# EAGLE schematic mem_board (EAGLE 6.4)
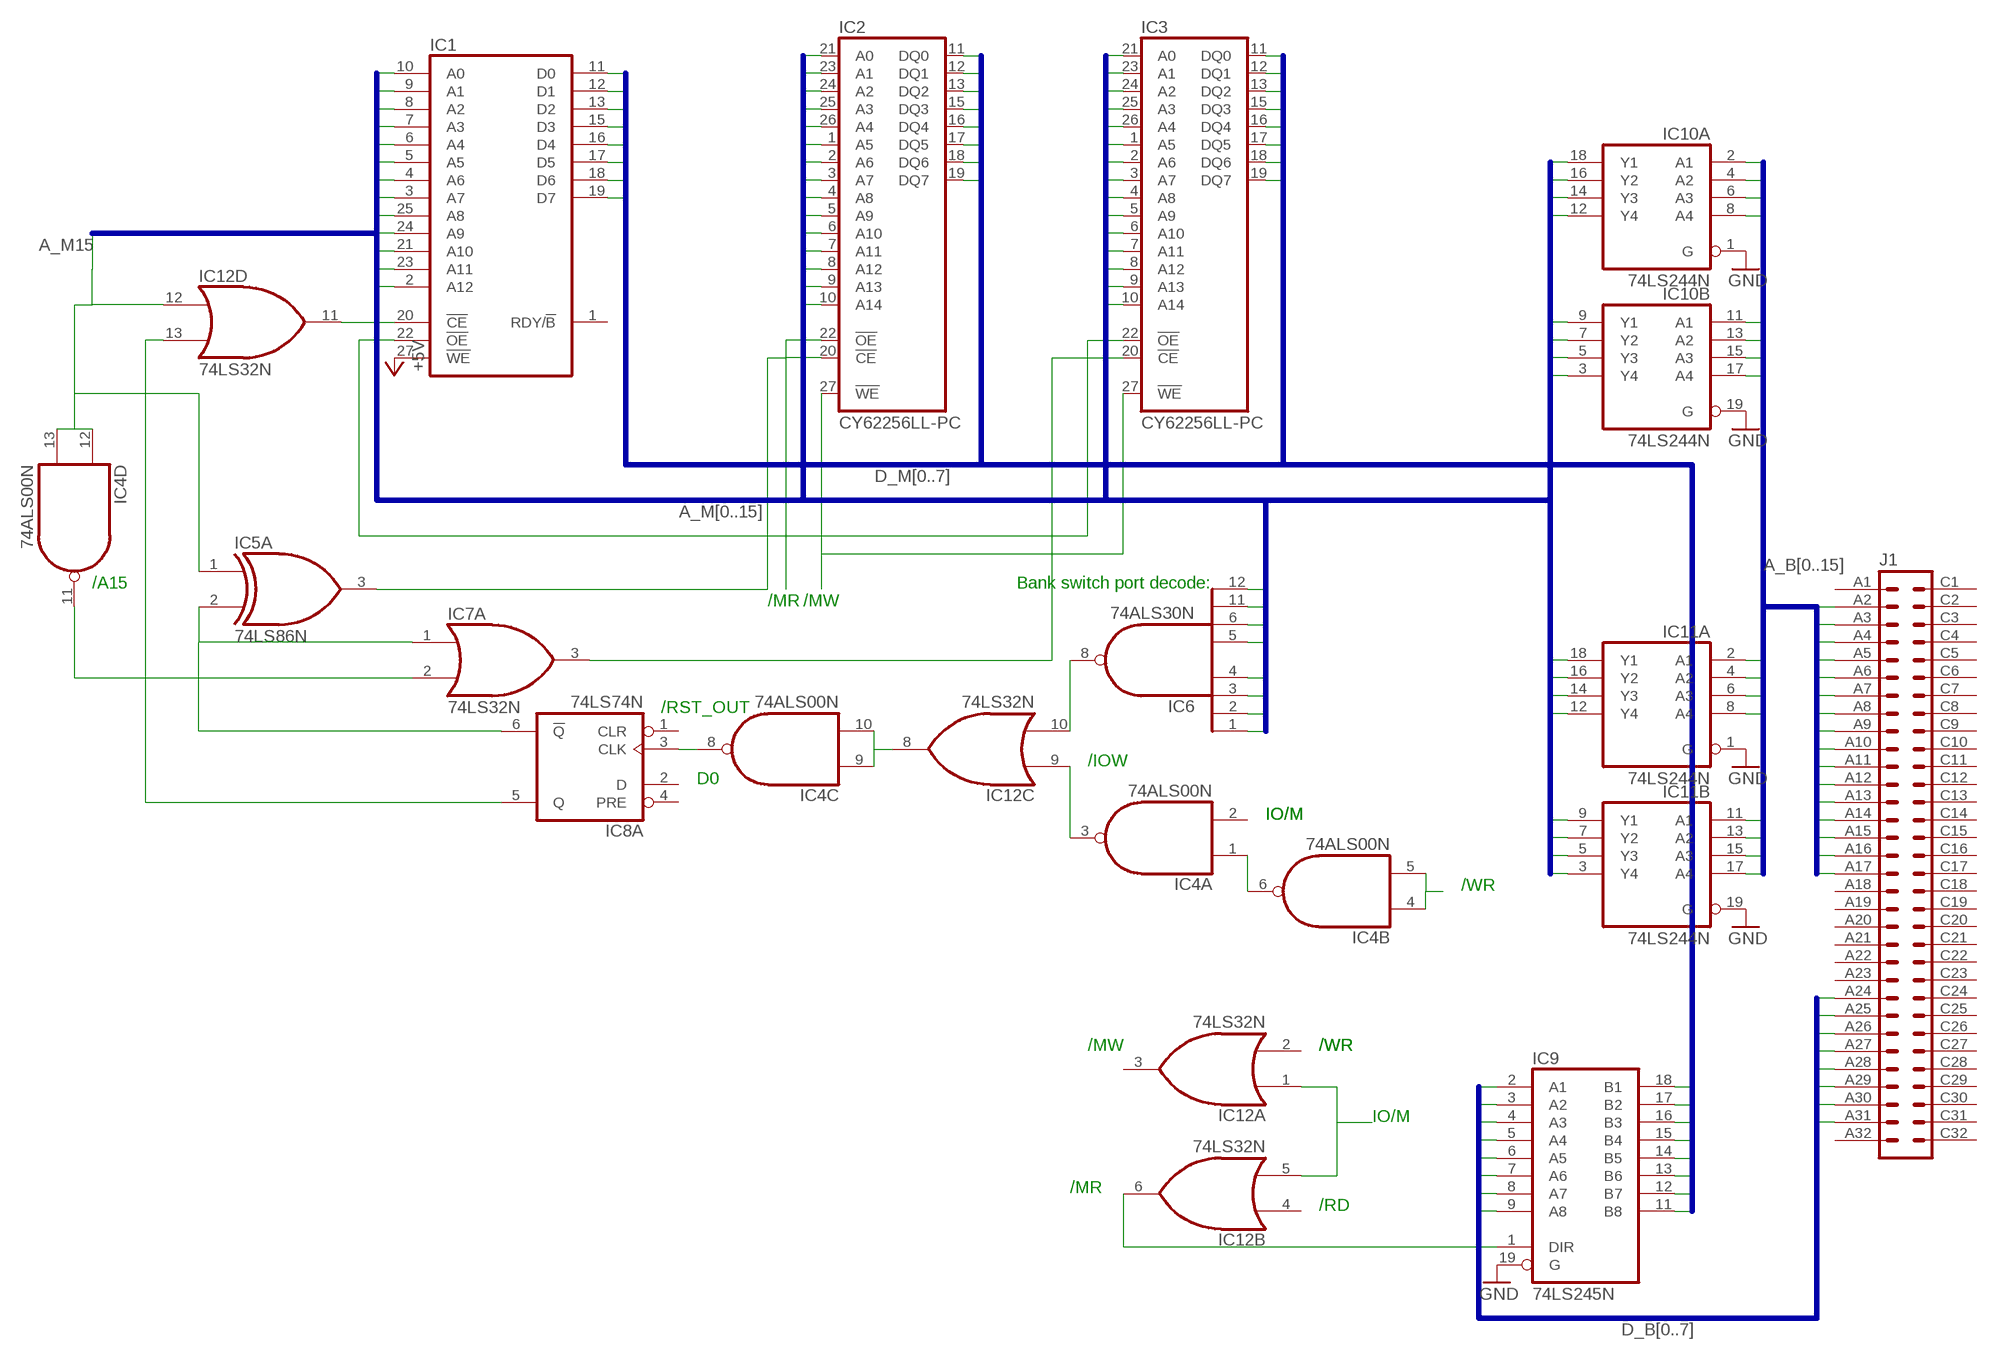
[diagram p0: schematic, sheet 1]

## Parts
IC1  2864  [DIL28]
IC2  CY62256LL-PC  [DIL28-6]
IC3  CY62256LL-PC  [DIL28-6]
IC4  74ALS00N  [DIL14]
IC5  74LS86N  [DIL14]
IC6  74ALS30N  [DIL14]
IC7  74LS32N  [DIL14]
IC8  74LS74N  [DIL14]
IC9  74LS245N  [DIL20]
IC10  74LS244N  [DIL20]
IC11  74LS244N  [DIL20]
IC12  74LS32N  [DIL14]
J1  VG64  [VG64]

## Nets
+5V: IC1.27(!WE)
A_B0: IC10.2(A:A1) J1.A2
A_B1: IC10.4(A:A2) J1.A3
A_B2: IC10.6(A:A3) J1.A4
A_B3: IC10.8(A:A4) J1.A5
A_B4: IC10.11(B:A1) J1.A6
A_B5: IC10.13(B:A2) J1.A7
A_B6: IC10.15(B:A3) J1.A8
A_B7: IC10.17(B:A4) J1.A9
A_B8: IC11.2(A:A1) J1.A10
A_B9: IC11.4(A:A2) J1.A11
A_B10: IC11.6(A:A3) J1.A12
A_B11: IC11.8(A:A4) J1.A13
A_B12: IC11.11(B:A1) J1.A14
A_B13: IC11.13(B:A2) J1.A15
A_B14: IC11.15(B:A3) J1.A16
A_B15: IC11.17(B:A4) J1.A17
A_M0: IC1.10(A0) IC2.21(A0) IC3.21(A0) IC6.12(I7) IC10.18(A:Y1)
A_M1: IC1.9(A1) IC2.23(A1) IC3.23(A1) IC6.11(I6) IC10.16(A:Y2)
A_M2: IC1.8(A2) IC2.24(A2) IC3.24(A2) IC6.6(I5) IC10.14(A:Y3)
A_M3: IC1.7(A3) IC2.25(A3) IC3.25(A3) IC6.5(I4) IC10.12(A:Y4)
A_M4: IC1.6(A4) IC2.26(A4) IC3.26(A4) IC6.4(I3) IC10.9(B:Y1)
A_M5: IC1.5(A5) IC2.1(A5) IC3.1(A5) IC6.3(I2) IC10.7(B:Y2)
A_M6: IC1.4(A6) IC2.2(A6) IC3.2(A6) IC6.2(I1) IC10.5(B:Y3)
A_M7: IC1.3(A7) IC2.3(A7) IC3.3(A7) IC6.1(I0) IC10.3(B:Y4) IC11.18(A:Y1)
A_M8: IC1.25(A8) IC2.4(A8) IC3.4(A8)
A_M9: IC1.24(A9) IC2.5(A9) IC3.5(A9) IC11.16(A:Y2)
A_M10: IC1.21(A10) IC2.6(A10) IC3.6(A10) IC11.14(A:Y3)
A_M11: IC1.23(A11) IC2.7(A11) IC3.7(A11) IC11.12(A:Y4)
A_M12: IC1.2(A12) IC2.8(A12) IC3.8(A12) IC11.9(B:Y1)
A_M13: IC2.9(A13) IC3.9(A13) IC11.7(B:Y2)
A_M14: IC2.10(A14) IC3.10(A14) IC11.5(B:Y3)
A_M15: IC11.3(B:Y4)
D_B0: IC9.2(A1) J1.A24
D_B1: IC9.3(A2) J1.A25
D_B2: IC9.4(A3) J1.A26
D_B3: IC9.5(A4) J1.A27
D_B4: IC9.6(A5) J1.A28
D_B5: IC9.7(A6) J1.A29
D_B6: IC9.8(A7) J1.A30
D_B7: IC9.9(A8) J1.A31
D_M0: IC1.11(D0) IC2.11(DQ0) IC3.11(DQ0) IC9.18(B1)
D_M1: IC1.12(D1) IC2.12(DQ1) IC3.12(DQ1) IC9.17(B2)
D_M2: IC1.13(D2) IC2.13(DQ2) IC3.13(DQ2) IC9.16(B3)
D_M3: IC1.15(D3) IC2.15(DQ3) IC3.15(DQ3) IC9.15(B4)
D_M4: IC1.16(D4) IC2.16(DQ4) IC3.16(DQ4) IC9.14(B5)
D_M5: IC1.17(D5) IC2.17(DQ5) IC3.17(DQ5) IC9.13(B6)
D_M6: IC1.18(D6) IC2.18(DQ6) IC3.18(DQ6) IC9.12(B7)
D_M7: IC1.19(D7) IC2.19(DQ7) IC3.19(DQ7) IC9.11(B8)
GND: IC9.19(G) IC10.1(A:G) IC10.19(B:G) IC11.1(A:G) IC11.19(B:G)
N$1: IC2.27(!WE) IC3.27(!WE)
N$2: IC1.22(!OE) IC2.20(!CE) IC2.22(!OE) IC3.22(!OE) IC5.3(A:O)
N$3: IC12.1(A:I0) IC12.5(B:I1)
N$4: IC4.8(C:O) IC8.3(A:CLK)
N$5: IC4.1(A:I0) IC4.6(B:O)
N$6: IC4.4(B:I0) IC4.5(B:I1)
N$7: IC6.8(O) IC12.10(C:I1)
N$8: IC9.1(DIR) IC12.6(B:O)
N$9: IC4.3(A:O) IC12.9(C:I0)
N$10: IC4.9(C:I0) IC4.10(C:I1) IC12.8(C:O)
N$11: IC1.20(!CE) IC12.11(D:O)
N$12: IC8.5(A:Q) IC12.13(D:I1)
N$13: IC4.12(D:I0) IC4.13(D:I1) IC5.1(A:I0) IC12.12(D:I0)
N$15: IC5.2(A:I1) IC7.1(A:I0) IC8.6(A:!Q)
N$17: IC4.11(D:O) IC7.2(A:I1)
N$18: IC3.20(!CE) IC7.3(A:O)
Unconnected: IC1.1(RDY/!B) IC4.2(A:I1) IC5.4(B:I0) IC5.5(B:I1) IC5.6(B:O) IC5.8(C:O) IC5.9(C:I0) IC5.10(C:I1) IC5.11(D:O) IC5.12(D:I0) IC5.13(D:I1) IC7.4(B:I0) IC7.5(B:I1) IC7.6(B:O) IC7.8(C:O) IC7.9(C:I0) IC7.10(C:I1) IC7.11(D:O) IC7.12(D:I0) IC7.13(D:I1) IC8.1(A:CLR) IC8.2(A:D) IC8.4(A:PRE) IC8.8(B:!Q) IC8.9(B:Q) IC8.10(B:PRE) IC8.11(B:CLK) IC8.12(B:D) IC8.13(B:CLR) IC12.2(A:I1) IC12.3(A:O) IC12.4(B:I0) J1.A1 J1.A18 J1.A19 J1.A20 J1.A21 J1.A22 J1.A23 J1.A32 J1.C1 J1.C2 J1.C3 J1.C4 J1.C5 J1.C6 J1.C7 J1.C8 J1.C9 J1.C10 J1.C11 J1.C12 J1.C13 J1.C14 J1.C15 J1.C16 J1.C17 J1.C18 J1.C19 J1.C20 J1.C21 J1.C22 J1.C23 J1.C24 J1.C25 J1.C26 J1.C27 J1.C28 J1.C29 J1.C30 J1.C31 J1.C32

## Buses
D_M[0..7]
A_M[0..15]
D_B[0..7]
A_B[0..15]

## Notes on the sheet
- /A15 | Bank switch port decode:
- /MR | /MW
- /RST_OUT
- /IOW
- D0
- IO/M | IO/M
- /WR
- /MW | /WR | /WR
- IO/M
- /MR
- /RD

## Power pins joined to a net without a drawn wire
GND: IC1.14(GND) IC2.14(GND) IC3.14(GND) IC4.7(P:GND) IC5.7(P:GND) IC6.7(GND) IC7.7(P:GND) IC8.7(P:GND) IC9.10(GND) IC10.10(P:GND) IC11.10(P:GND) IC12.7(P:GND)
VCC: IC1.28(VCC) IC2.28(VCC) IC3.28(VCC) IC4.14(P:VCC) IC5.14(P:VCC) IC6.14(VCC) IC7.14(P:VCC) IC8.14(P:VCC) IC9.20(VCC) IC10.20(P:VCC) IC11.20(P:VCC) IC12.14(P:VCC)

## Library data of the parts
IC1 = memory:2864: MEMORY
IC2 IC3 = memory-sram:CY62256LL-?*: 256K (32K x 8) CMOS-Static RAM Source: http://download.cypress.com.edgesuite.net/design_resources/datasheets/contents/cy62256_8.pdf
IC4 = 74xx-us:74*00: Quad 2-input NAND gate
IC5 = 74xx-us:74*86: Quad 2-input EXCLUSIV-OR (XOR) gate
IC6 = 74xx-us:74*30: 8-input NAND gate
IC7 IC12 = 74xx-us:74*32: Quad 2-input OR gate
IC8 = 74xx-us:74*74: Dual D type positive edge triggered FLIP FLOP, preset and clear
IC9 = 74xx-us:74*245: Octal BUS TRANSCEIVER, 3-state
IC10 IC11 = 74xx-us:74*244: Octal BUFFER and LINE DRIVER, 3-state
J1 = 19inch:VG64: PCB EUROCARD, 64-pin type C/AC, 2.54 mm